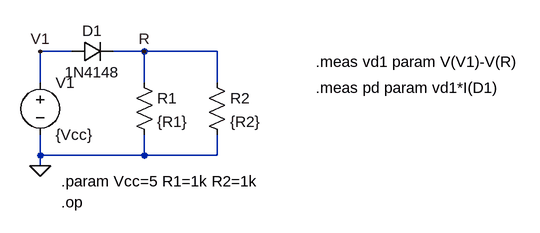
[diagram p0: schematic steptest.asc]
steptest.asc, the LTspice schematic file:
Version 4
SHEET 1 880 680
WIRE 160 64 112 64
WIRE 272 64 224 64
WIRE 384 64 272 64
WIRE 112 112 112 64
WIRE 272 112 272 64
WIRE 384 112 384 64
WIRE 112 224 112 192
WIRE 272 224 272 192
WIRE 272 224 112 224
WIRE 384 224 384 192
WIRE 384 224 272 224
WIRE 112 240 112 224
FLAG 112 240 0
FLAG 112 64 V1
FLAG 272 64 R
SYMBOL voltage 112 96 R0
WINDOW 123 0 0 Left 0
WINDOW 39 0 0 Left 0
SYMATTR InstName V1
SYMATTR Value {Vcc}
SYMBOL res 256 96 R0
SYMATTR InstName R1
SYMATTR Value {R1}
SYMBOL diode 160 80 R270
WINDOW 0 32 32 VTop 2
WINDOW 3 0 32 VBottom 2
SYMATTR InstName D1
SYMATTR Value 1N4148
SYMBOL res 368 96 R0
SYMATTR InstName R2
SYMATTR Value {R2}
TEXT 144 296 Left 2 !.op
TEXT 144 264 Left 2 !.param Vcc=5 R1=1k R2=1k
TEXT 536 80 Left 2 !.meas vd1 param V(V1)-V(R)
TEXT 536 120 Left 2 !.meas pd param vd1*I(D1)

The netlist it stands for:
* steptest.asc
V1 V1 0 {Vcc}
R1 R 0 {R1}
D1 V1 R 1N4148
R2 R 0 {R2}
.model D D
.lib standard.dio
.op
.param Vcc=5 R1=1k R2=1k
.meas vd1 param V(V1)-V(R)
.meas pd param vd1*I(D1)
.backanno
.end